# Altium schematic sheet PowerSection.SchDoc: Power Section
size 420 x 297 mm; SheetNumber: 3
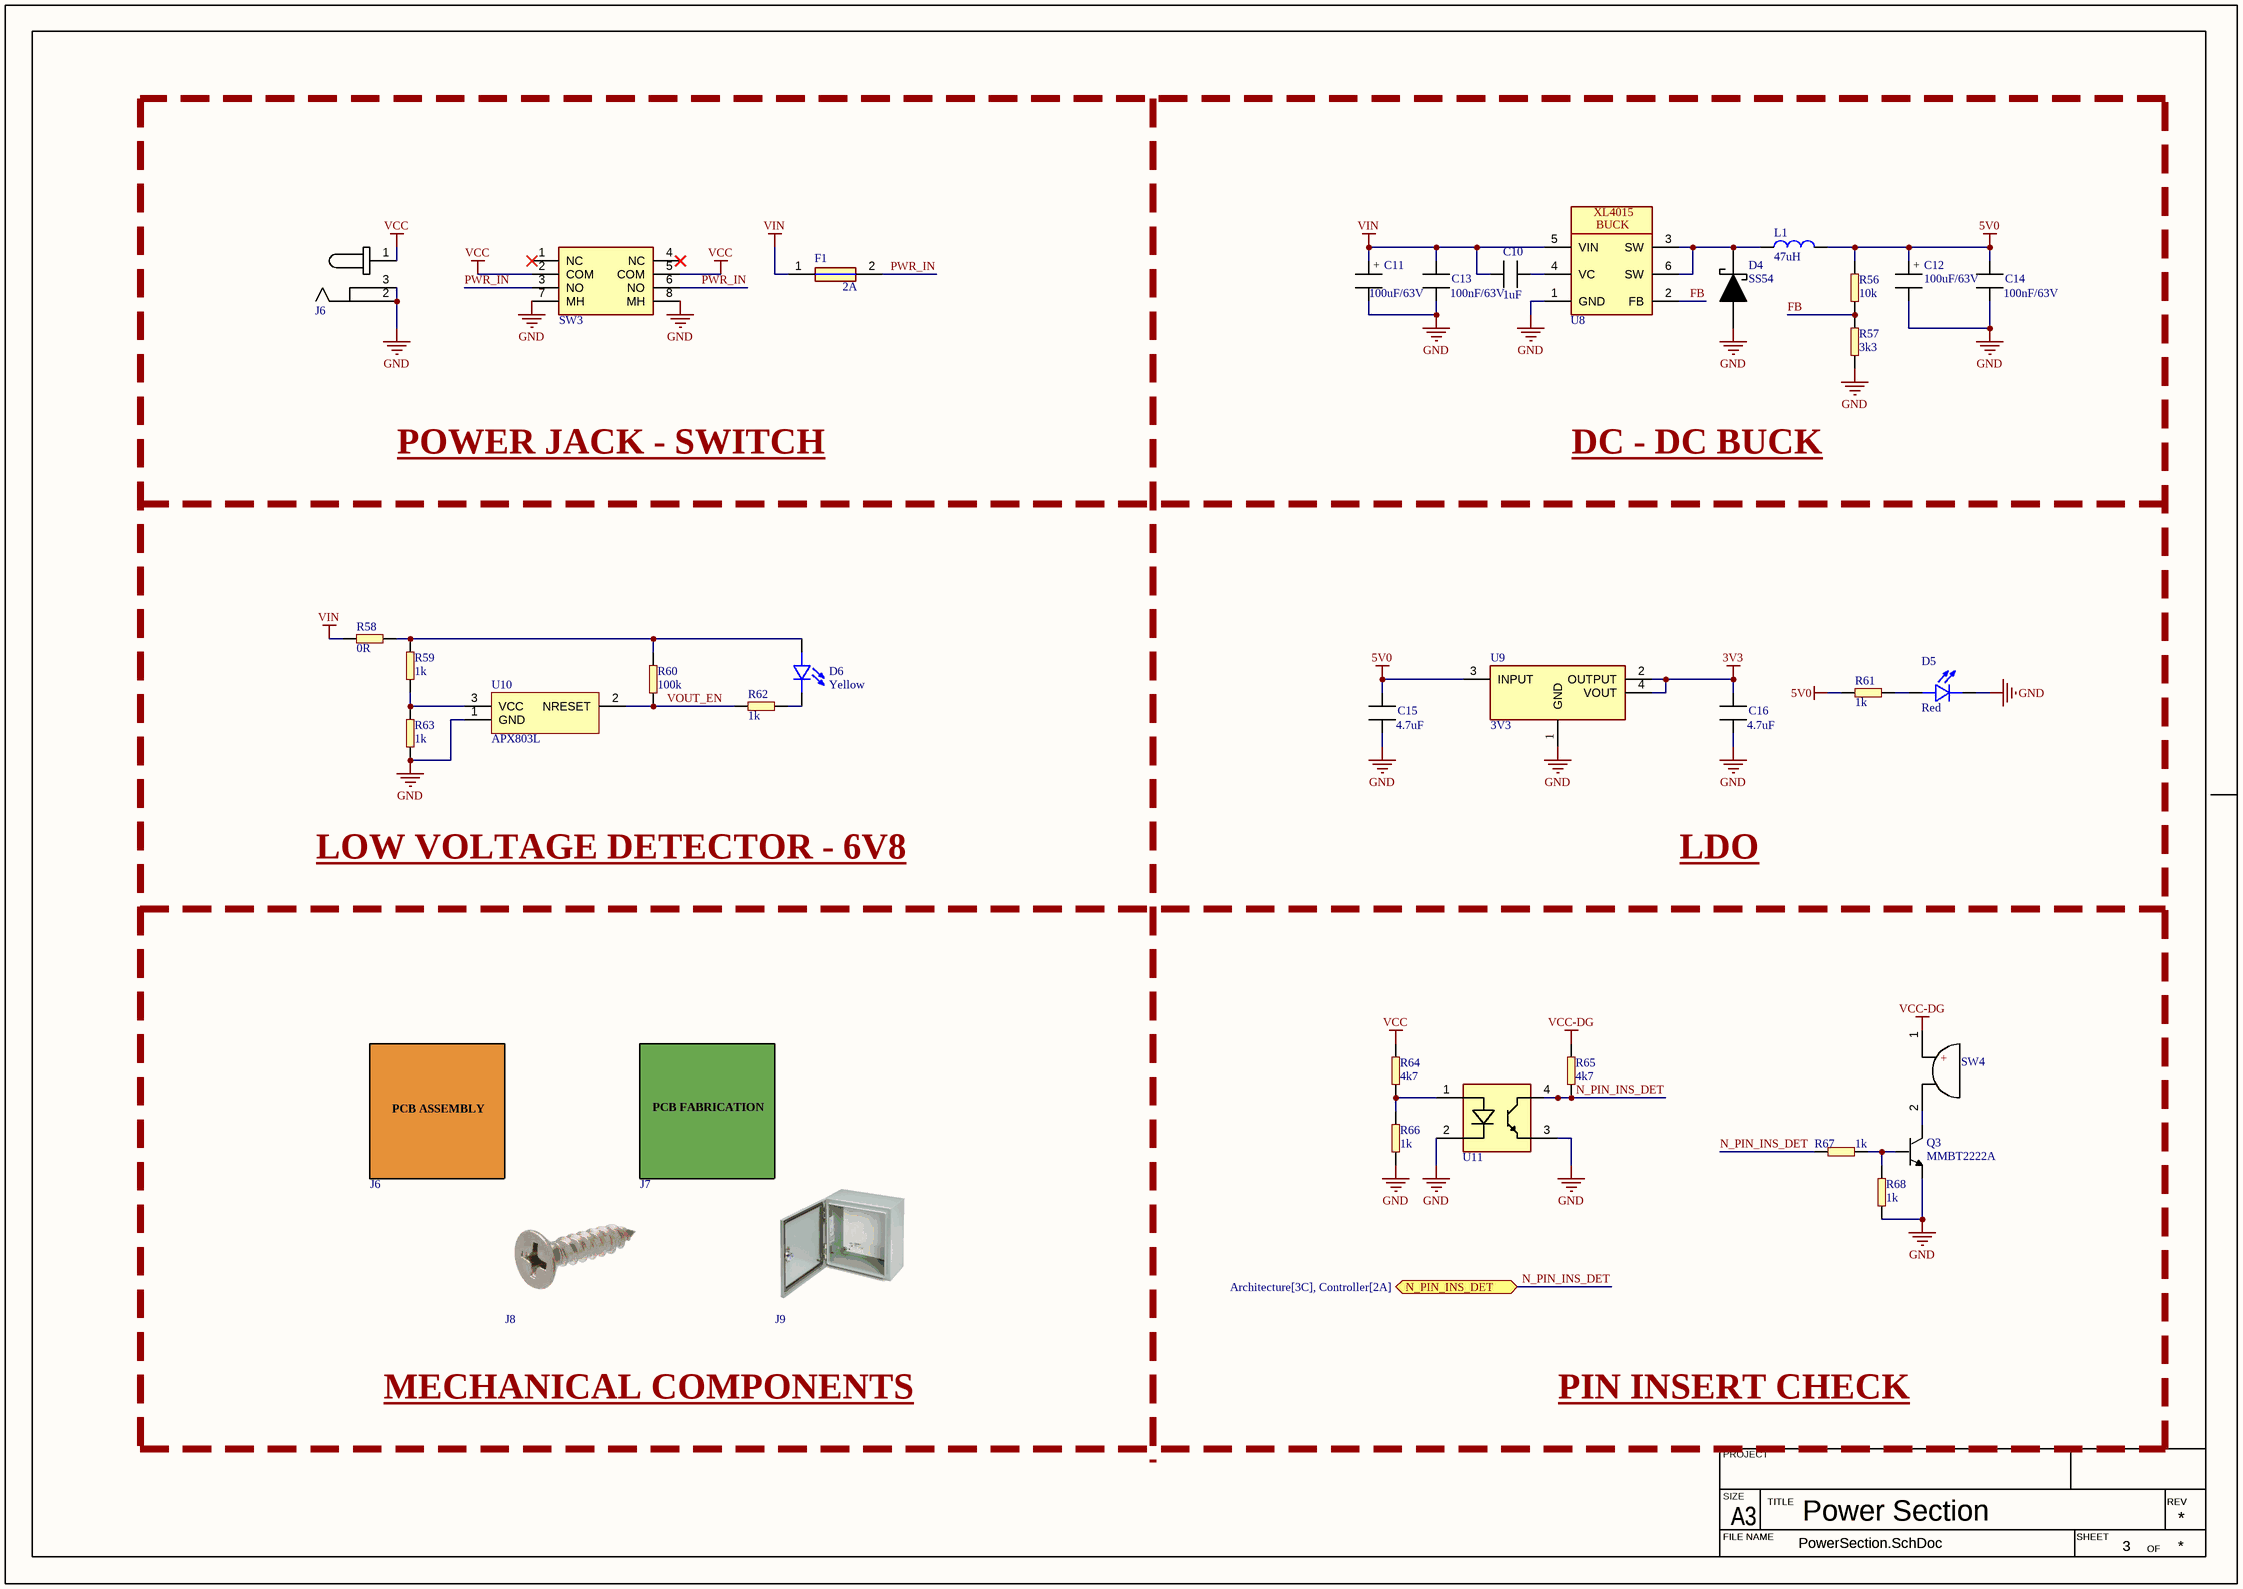
[diagram p0: PowerSection.SchDoc]

## Parts
(Parts that share a designator on the sheet are numbered #1, #2 ... from top to bottom, then left to right.)
C10  value 1uF  [CAPC1608X10N]  (hidden comment: ERP_102-1)
C11  value 100uF/63V  [CAP_D12.5_H21_P5]  (hidden comment: ERP_102-2)
C12  value 100uF/63V  [CAP_D12.5_H21_P5]  (hidden comment: ERP_102-2)
C13  value 100nF/63V  [CAPC1608X10N]  (hidden comment: ERP_102-1)
C14  value 100nF/63V  [CAPC1608X10N]  (hidden comment: ERP_102-1)
C15  value 4.7uF  [CAPC1608X10N]  (hidden comment: ERP_102-1)
C16  value 4.7uF  [CAPC1608X10N]  (hidden comment: ERP_102-1)
D4  value SS54  [DIOM6959X26L]  (hidden comment: ERP_104-3)
D5  value Red  [LED_3MM_RED_RIGHT_ANGLE]  (hidden comment: LED_3MM_RIGHT_ANGLE)
D6  value Yellow  [LED_3MM_YELLOW_RIGHT_ANGLE]  (hidden comment: LED_3MM_RIGHT_ANGLE)
F1  value 2A  [0679L]  (hidden comment: 0679L)
J6#1  KLDX-0202-AC  [KLDX-0202-AC]  (value not drawn)
J6#2  APCB  (value not drawn)  (graphical)
J7  BPCB  (value not drawn)  (graphical)
J8  SCREW  (value not drawn)  (graphical)
J9  ENCLOSURE  (value not drawn)  (graphical)
L1  value 47uH  [IND_1212]  (hidden comment: ERP_103-3)
Q3  value MMBT2222A  [MMBT2222]  (hidden comment: ERP_105-1)
R56  value 10k  [RES_0603]  (hidden comment: ERP_101-1)
R57  value 3k3  [RES_0603]  (hidden comment: ERP_101-1)
R58  value 0R  [RES_0603]  (hidden comment: ERP_101-1)
R59  value 1k  [RES_0603]  (hidden comment: ERP_101-1)
R60  value 100k  [RES_0603]  (hidden comment: ERP_101-1)
R61  value 1k  [RES_0603]  (hidden comment: ERP_101-1)
R62  value 1k  [RES_0603]  (hidden comment: ERP_101-1)
R63  value 1k  [RES_0603]  (hidden comment: ERP_101-1)
R64  value 4k7  [RES_0603]  (hidden comment: ERP_101-1)
R65  value 4k7  [RES_0603]  (hidden comment: ERP_101-1)
R66  value 1k  [RES_0603]  (hidden comment: ERP_101-1)
R67  value 1k  [RES_0603]  (hidden comment: ERP_101-1)
R68  value 1k  [RES_0603]  (hidden comment: ERP_101-1)
SW3  ERP_110-4  [PBH2U]  (value not drawn)
SW4  ERP_110-4  [ActiveBuzzer12MM]  (value not drawn)
U8  XL4015  [XL4015]  (value not drawn)
U9  value 3V3  [AMS1117_SOT223]  (hidden comment: ERP_123-1)
U10  APX803L  [APX803L]
U11  FOD817A3SD  [FOD817A3SD]  (value not drawn)

## Ports
N_PIN_INS_DET (bidir, see Architecture[3C], Controller[2A])

## Nets
3V3: C16.1 U9.2(OUTPUT) U9.4(VOUT)
5V0: C12.1 C14.1 C15.1 L1.2 R56.2 R61.1 U9.3(INPUT)
GND: C11.2 C12.2 C13.2 C14.2 C15.2 C16.2 D4.2(A) D5.2 J6#1.2 J6#1.3 Q3.2 R57.1 R63.1 R66.1 R68.2 SW3.7(MH) SW3.8(MH) U8.1(GND) U9.1(GND) U10.1(GND) U11.2(CATHODE) U11.3(EMITTER)
VCC: J6#1.1 R64.2 SW3.2(COM) SW3.5(COM)
VCC-DG: R65.2 SW4.1(+)
VIN: C10.1 C11.1 C13.1 F1.1 R58.2 U8.5(VIN)
FB: R56.1 R57.2 U8.2(FB)
N_PIN_INS_DET: R65.1 R67.2 U11.4(COLLECTOR) ; port N_PIN_INS_DET
PWR_IN: F1.2 SW3.3(NO) SW3.6(NO)
VOUT_EN: R60.1 R62.1 U10.2(NRESET)
NetC10_2: C10.2 U8.4(VC)
NetD4_1: D4.1(C) L1.1 U8.3(SW) U8.6(SW)
NetD5_1: D5.1 R61.2
NetD6_1: D6.1 R58.1 R59.2 R60.2
NetD6_2: D6.2 R62.2
NetQ3_1: Q3.1 R67.1 R68.1
NetQ3_3: Q3.3 SW4.2(-)
NetR59_1: R59.1 R63.2 U10.3(VCC)
NetR64_1: R64.1 R66.2 U11.1(ANODE)

Not connected (* = marked no-connect by the designer): SW3 1(NC)* 4(NC)*

## Notes on the sheet
- POWER JACK - SWITCH
- DC - DC BUCK
- LOW VOLTAGE DETECTOR - 6V8
- LDO
- MECHANICAL COMPONENTS
- PIN INSERT CHECK
- PROJECT
- SIZE
- FILE NAME
- A3
- TITLE
- SHEET
- OF
- REV
- (in symbol APCB) PCB ASSEMBLY
- (in symbol BPCB) PCB FABRICATION
- (in symbol CAP_D12.5_H21_P5) +
- (in symbol XL4015) BUCK

## Library data of the parts
C10 C13 C14 = MLCC_0603: Chip Capacitor, 2-Leads, Body 1.60x0.80mm, IPC Medium Density; Package: 0603; Manufacturer 1: *; Manufacturer Part Number 1: *; Supplier 1: *; Suuplier Part Number 1: *; ERP: *
C11 C12 = CAP_D12.5_H21_P5: Electrolytic Capacitor Through Hole D12.5 P5.0; Manufacturer 1: Sharvi; Manufacturer Part Number 1: ST2136CO4725; Package: 12.5X5; Supplier 1: *
C15 C16 = MLCC_0603: MLCC 0603; Manufacturer 1: Murata; Manufacturer Part Number 1: GRM188R6YA475KE15D; Package: 0603; Suuplier Part Number 1: *; ERP: *; Supplier 1: Digikey; Supplier Part Number 1: 490-7205-1-ND
D4 = SS54: Manufacturer Part Number 1: ST2103SD0940; Manufacturer 1: Sharvi; Supplier Part Number 1: *; Supplier  1: *; Package: SMC; ERP: *
D5 D6 = LED_3MM_RIGHT_ANGLE: LED_3MM
F1 = 0679L: FUSE BRD MNT 2SMD; Manufacturer Part Number 1: ST2103SD1995; Manufacturer 1: Sharvi
J6#1 = KLDX-0202-AC: CONN PWR JACK 2X5.5MM KINKED PIN; Manufacturer 1: Sharvi; Manufacturer Part Number 1: ST2001CO0701; Value: NA
J6#2 = APCB: Assembled PCB; Value: *; Manufacturer 1: *; Manufacturer Part Number 1: *
J7 = BPCB: Bare PCB; Manufacturer Part Number 1: *; Manufacturer 1: *; Value: *
J8 = SCREW: Mounting Screw
J9 = ENCLOSURE: PCB Enclosure; Manufacturer Part Number 1: *; Manufacturer 1: *; Value: *
L1 = IND_1212: Manufacturer Part Number 1: ST2103SD1710; Manufacturer 1: Sharvi
Q3 = MMBT2222: MMBT2222A; ERP: *; Suuplier Part Number 1: *; Supplier 1: *; Manufacturer Part Number 1: *; Manufacturer 1: *; Package: SOT23
R56 = RES_0603: Manufacturer 1: YAGEO; Manufacturer Part Number 1: RC0603FR-07301KL; Package: 0603; Supplier 1: *; Supplier Part Number 1: *; ERP: *
R57 = RES_0603: Manufacturer 1: YAGEO; Manufacturer Part Number 1: RC0603FR-0757K6L; Package: 0603; Supplier 1: *; Supplier Part Number 1: *; ERP: *
R58 R59 R61-R65 R67 R68 = RES_0603: Manufacturer 1: YAGEO; Manufacturer Part Number 1: RC0603FR-071KL; Package: 0603; ERP: *
R60 R66 = RES_0603: Manufacturer Part Number 1: RC0603FR-07100KL; Package: 0603; Manufacturer 1: *; ERP: *
  R60: Supplier 1: *; Supplier Part Number 1: *
SW3 = PBH2U: Pushbutton Switch DPDT Standard Through Hole, Right Angle; Manufacturer Part Number 1: ST2106CO3161; Manufacturer 1: Sharvi; Package: *; Value: *
SW4 = ActiveBuzzer12MM: SWITCH SLIDE SPDT 200MA 30V; Manufacturer Part Number 1: 4149; Manufacturer 1: Sunrom; Value: *
U8 = XL4015: 5A 180KHz 36V Buck DC to DC Converter; Manufacturer 1: Sharvi; Manufacturer Part Number 1: ST2103SD1331; Value: *
U9 = AMS1117_SOT223: AMS1117 LDO; Supplier  Part Number 1: *; Supplier  1: *; Package: SOT223; Manufacturer Part Number 1: *; Manufacturer 1: *; ERP: *
U10 = APX803L: IC SUPERVISOR 1 CHANNEL SOT23; Manufacturer Part Number 1: APX803L20-35SA-7; Manufacturer 1: Diodes Incorporated; Value: APX803L
U11 = FOD817A3SD: OPTOISOLATOR 5KV TRANSISTOR 4SMD; Manufacturer: onsemi; Value: *; Manufacturer Part Number 1: FOD817A3SD